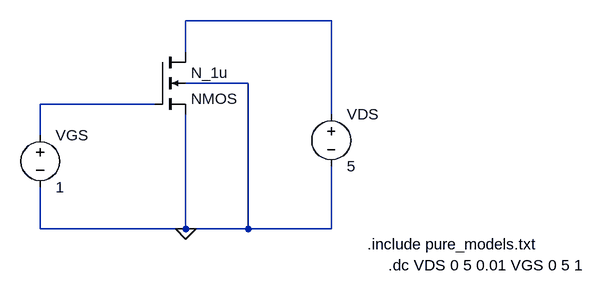
[diagram p0: schematic Nmos_long_channel.asc]
Nmos_long_channel.asc, the LTspice schematic file:
Version 4
SHEET 1 880 680
WIRE 384 32 160 32
WIRE 160 80 160 32
WIRE 256 128 160 128
WIRE 112 160 -64 160
WIRE 384 176 384 32
WIRE -64 208 -64 160
WIRE -64 352 -64 288
WIRE 160 352 160 176
WIRE 160 352 -64 352
WIRE 256 352 256 128
WIRE 256 352 160 352
WIRE 384 352 384 256
WIRE 384 352 256 352
FLAG 160 352 0
SYMBOL nmos4 112 80 R0
SYMATTR InstName N_1u
SYMATTR Value2 l=1u w=2u
SYMBOL voltage 384 160 R0
WINDOW 123 0 0 Left 0
WINDOW 39 0 0 Left 0
SYMATTR InstName VDS
SYMATTR Value 5
SYMBOL voltage -64 192 R0
WINDOW 123 0 0 Left 0
WINDOW 39 0 0 Left 0
SYMATTR InstName VGS
SYMATTR Value 1
TEXT 440 376 Left 2 !.include pure_models.txt
TEXT 472 408 Left 2 !.dc VDS 0 5 0.01 VGS 0 5 1

The netlist it stands for:
* Nmos_long_channel.asc
M§N_1u N001 N002 0 0 NMOS l=1u w=2u
VDS N001 0 5
VGS N002 0 1
.model NMOS NMOS
.model PMOS PMOS
.lib standard.mos
.include pure_models.txt
.dc VDS 0 5 0.01 VGS 0 5 1
.backanno
.end